# EAGLE design Board (EAGLE 9.0.1)
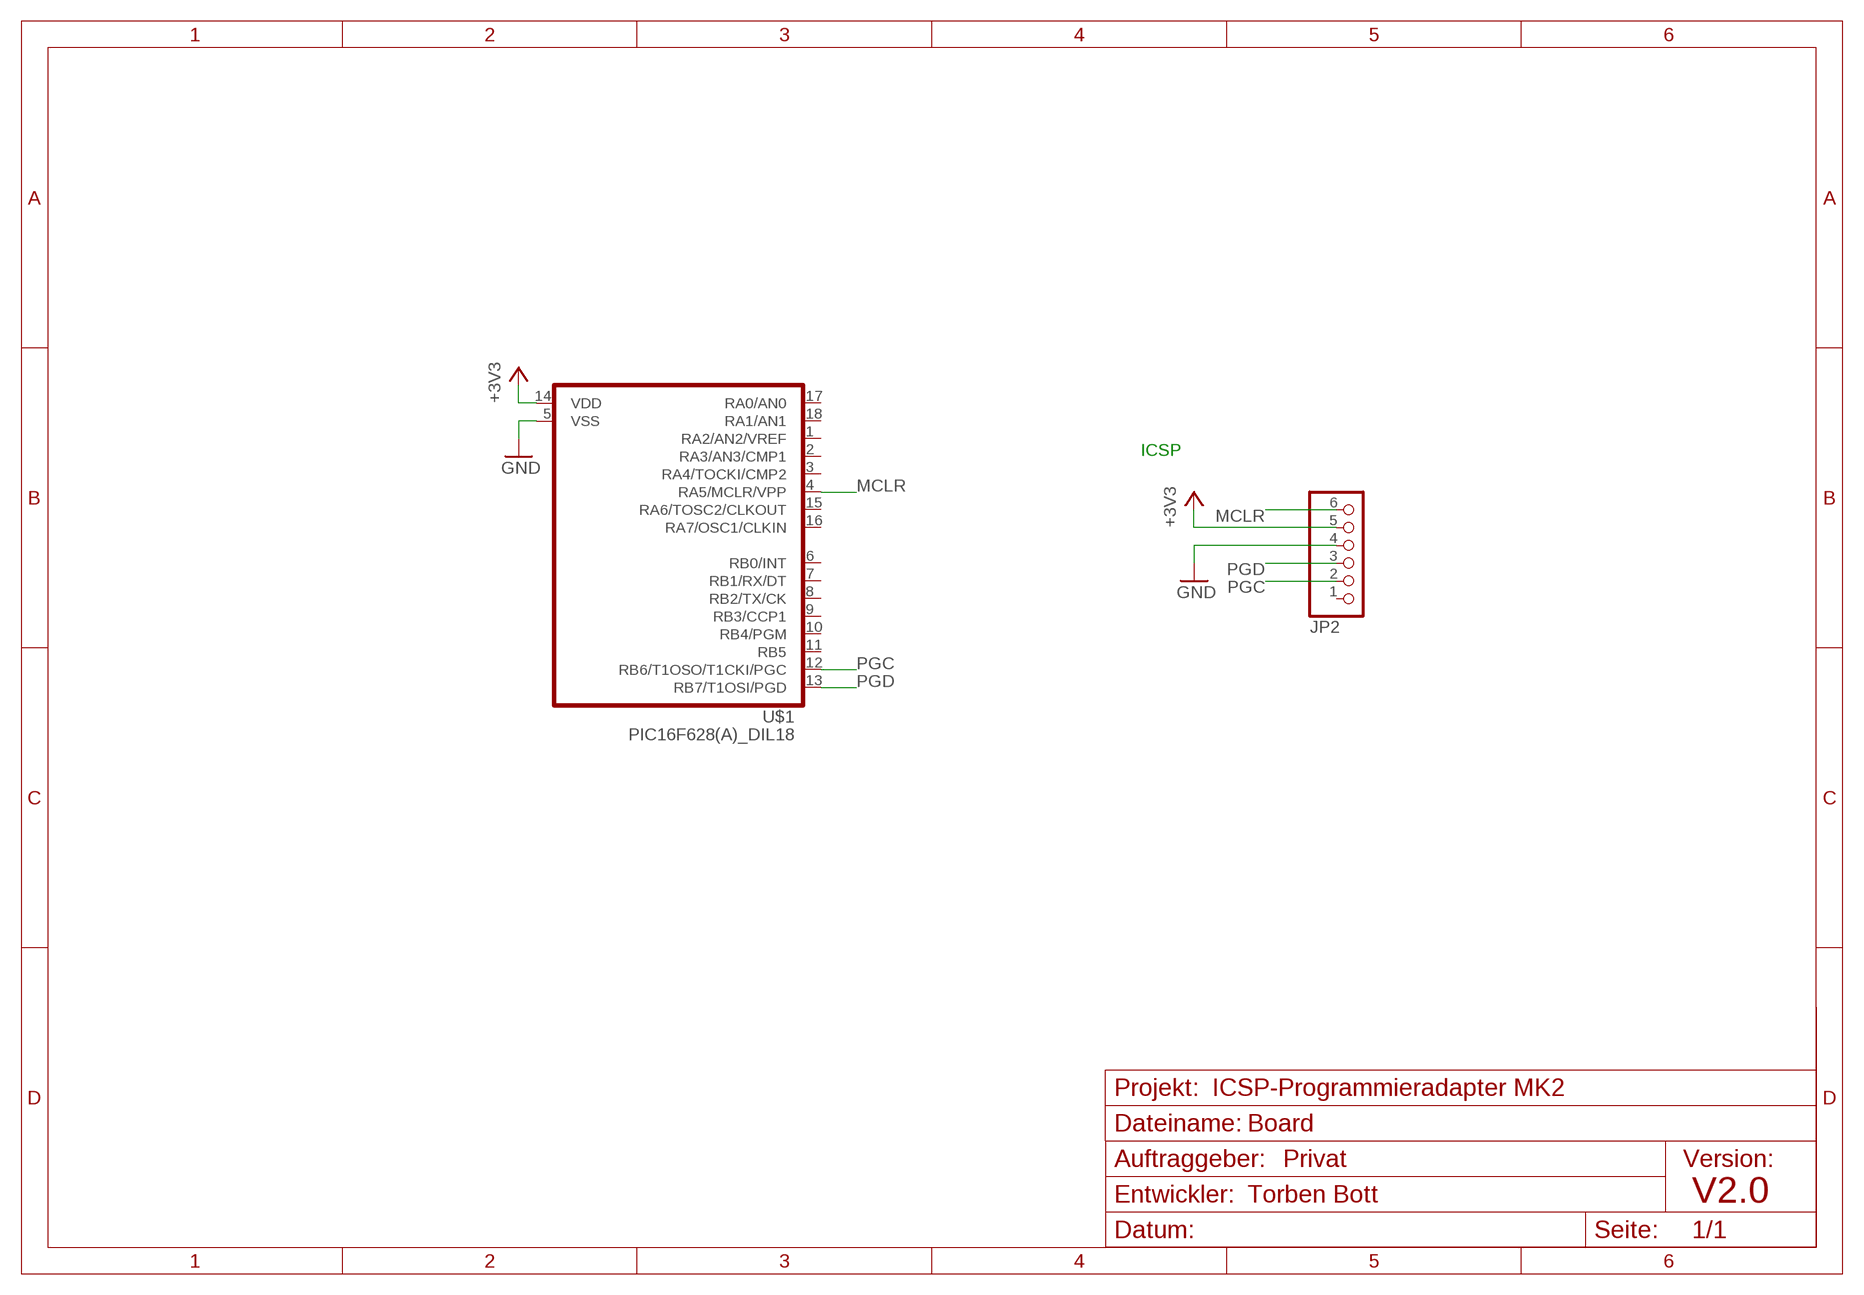
[diagram p0: schematic, sheet 1]

## Parts
JP2  PINHD-1X6/90  [1X06/90]
U$1  PIC16F628(A)_DIL18  [DIL18]

## Nets
+3V3: JP2.5 U$1.14(VDD)
GND: JP2.4 U$1.5(VSS)
MCLR: JP2.6 U$1.4(RA5/MCLR/VPP)
PGC: JP2.2 U$1.12(RB6/T1OSO/T1CKI/PGC)
PGD: JP2.3 U$1.13(RB7/T1OSI/PGD)
Unconnected: JP2.1 U$1.1(RA2/AN2/VREF) U$1.2(RA3/AN3/CMP1) U$1.3(RA4/TOCKI/CMP2) U$1.6(RB0/INT) U$1.7(RB1/RX/DT) U$1.8(RB2/TX/CK) U$1.9(RB3/CCP1) U$1.10(RB4/PGM) U$1.11(RB5) U$1.15(RA6/TOSC2/CLKOUT) U$1.16(RA7/OSC1/CLKIN) U$1.17(RA0/AN0) U$1.18(RA1/AN1)

## Notes on the sheet
- ICSP
- ICSP-Programmieradapter MK2
- Privat
- Torben Bott | V2.0

## Library data of the parts
JP2 = pinhead:PINHD-1X6: PIN HEADER
U$1 = Eigene Library:PIC16F628(A)_DIL18: https://www.dropbox.com/sh/d34mq8rgkb9s541/Z9QmiSr8ls

## Board
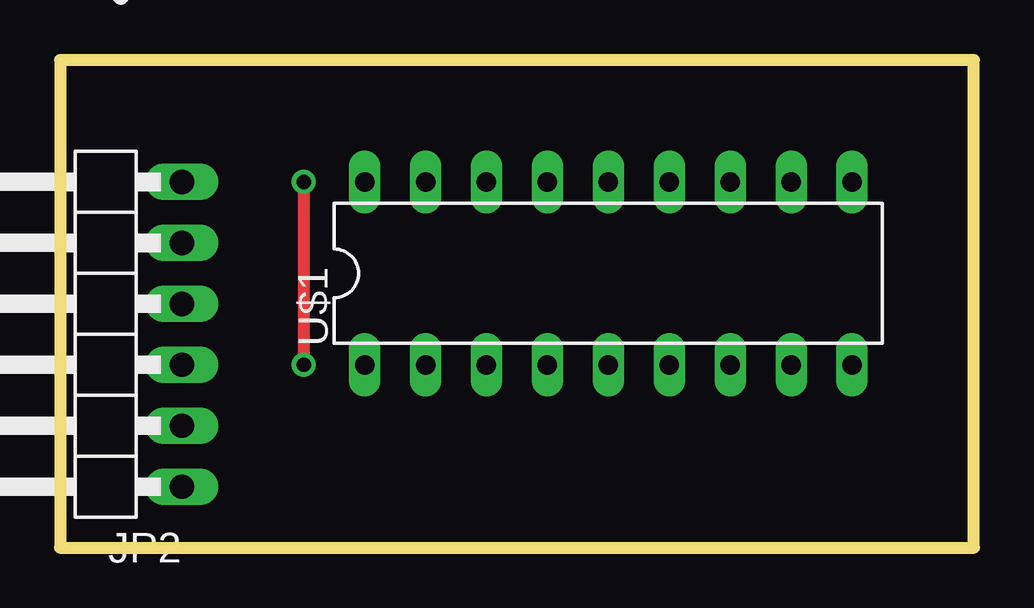
[diagram p1: board, top side]
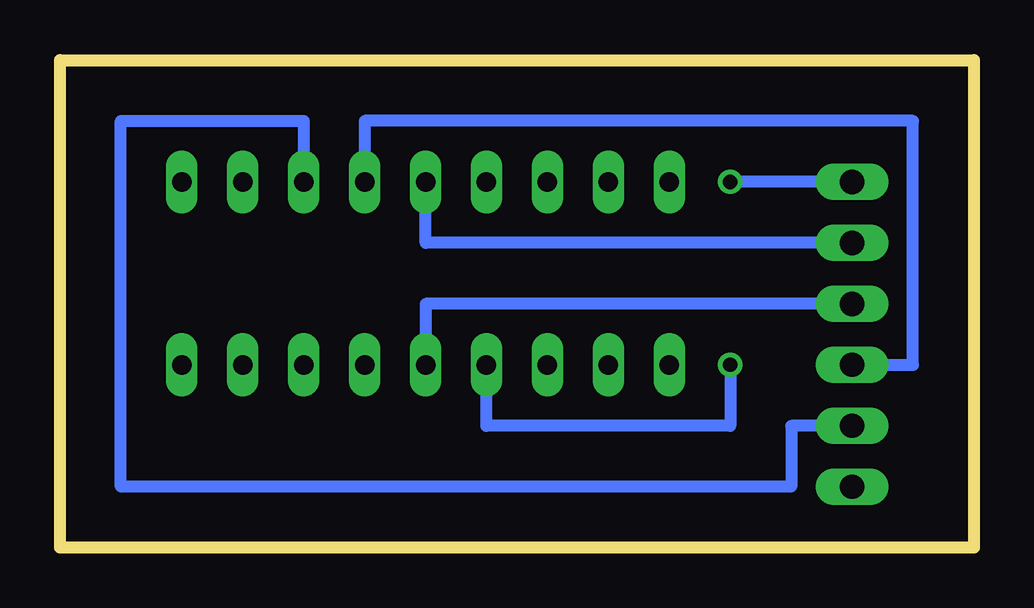
[diagram p2: board, bottom side, seen from below]

Size 38.1 x 20.32 mm. Coordinates in mm from the lower left corner, seen from the top.
Outline: 0,20.32 0,0 38.1,0 38.1,20.32 0,20.32
Copper layers (1*16): Top 0.035mm / dielectric 1.5mm / Bottom 0.035mm
Design rules "default": minimum track width 6mil, minimum drill 0.35mm, track to track 6mil, track to pad 6mil, pad to pad 6mil, via to via 6mil, smd to smd 6mil, copper to edge 40mil, drill to drill 6mil, minimum pad ring 10mil, minimum via ring 8mil, stop-mask expansion 4mil, vias tented up to drill 0mil, thermal gap 10mil

### Footprints (pad centres in the part's own frame; a part is rotated, then mirrored left to right if it is on the bottom)
1X06/90 = drill 1.016 long: 1 -6.35,-3.81; 2 -3.81,-3.81; 3 -1.27,-3.81; 4 1.27,-3.81; 5 3.81,-3.81; 6 6.35,-3.81
DIL18 = drill 0.813 long: 1 -10.16,-3.81; 2 -7.62,-3.81; 3 -5.08,-3.81; 4 -2.54,-3.81; 5 0,-3.81; 6 2.54,-3.81; 7 5.08,-3.81; 8 7.62,-3.81; 9 10.16,-3.81; 10 10.16,3.81; 11 7.62,3.81; 12 5.08,3.81; 13 2.54,3.81; 14 0,3.81; 15 -2.54,3.81; 16 -5.08,3.81; 17 -7.62,3.81; 18 -10.16,3.81

### Placement (x,y rotation side)
JP2  1.27,8.89 90 top
U$1  22.86,11.43 0 top

### Tracks (layer width: path | path; a pad name or v marks a point on that pad's centre or on a via)
+3V3
  Bottom 0.508: JP2.5 22.86,12.7 U$1.14
GND
  Bottom 0.508: JP2.4 22.86,10.16 U$1.5
MCLR  (via drill 0.6)
  Top 0.508: v10.16,15.24 v10.16,7.62
  Bottom 0.508: JP2.6 v10.16,15.24 | v10.16,7.62 10.16,5.08 20.32,5.08 U$1.4
PGC
  Bottom 0.508: JP2.2 7.62,5.08 7.62,2.54 35.56,2.54 35.56,17.78 27.94,17.78 U$1.12
PGD
  Bottom 0.508: JP2.3 2.54,7.62 2.54,17.78 25.4,17.78 U$1.13